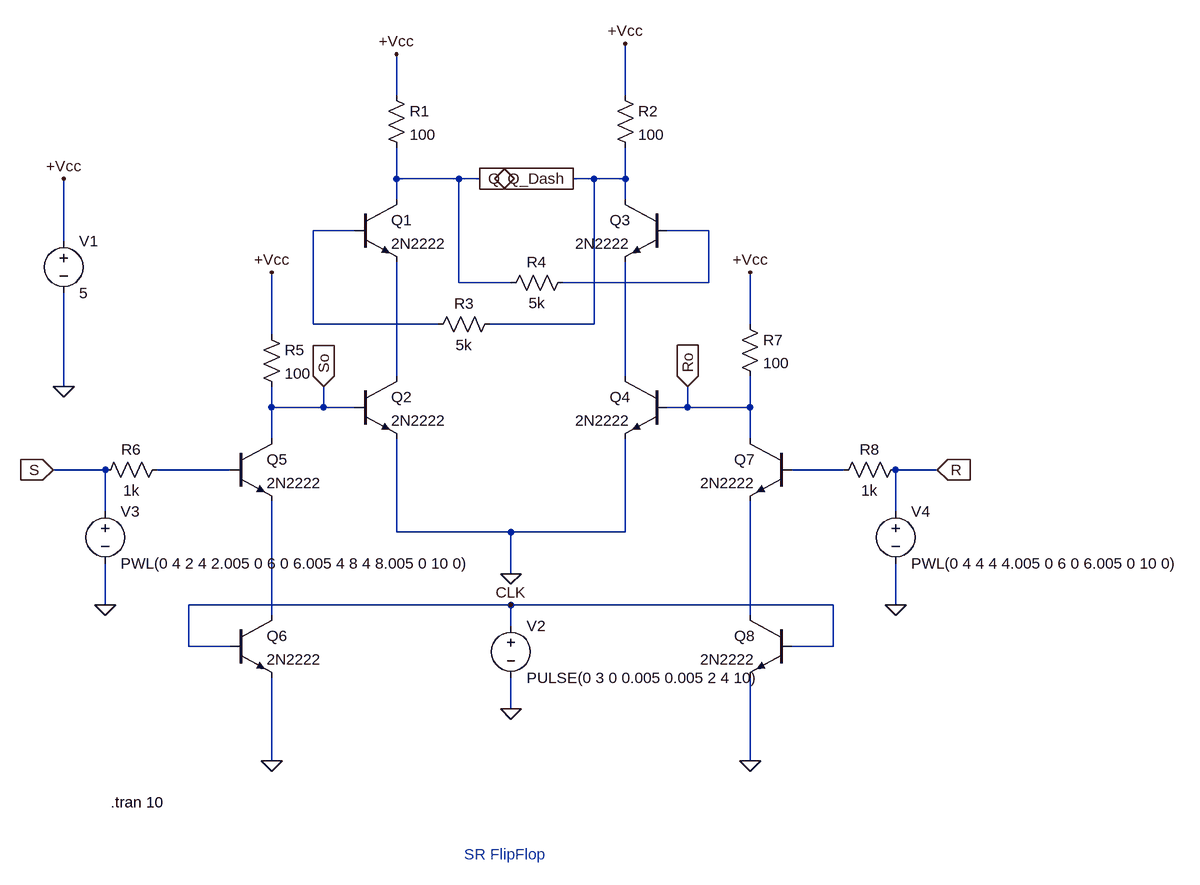
[diagram p0: schematic SR FlipFlop.asc]
SR FlipFlop.asc, the LTspice schematic file:
Version 4
SHEET 1 1156 800
WIRE -80 -384 -80 -448
WIRE 272 -384 272 -464
WIRE -80 -256 -80 -304
WIRE 16 -256 -80 -256
WIRE 48 -256 16 -256
WIRE 224 -256 192 -256
WIRE 272 -256 272 -304
WIRE 272 -256 224 -256
WIRE -80 -224 -80 -256
WIRE 272 -224 272 -256
WIRE -144 -176 -208 -176
WIRE 400 -176 336 -176
WIRE -592 -160 -592 -256
WIRE 16 -96 16 -256
WIRE 96 -96 16 -96
WIRE 400 -96 400 -176
WIRE 400 -96 176 -96
WIRE -208 -32 -208 -176
WIRE -16 -32 -208 -32
WIRE 224 -32 224 -256
WIRE 224 -32 64 -32
WIRE 464 -32 464 -112
WIRE -272 -16 -272 -112
WIRE -80 48 -80 -128
WIRE 272 48 272 -128
WIRE -592 64 -592 -80
WIRE -272 96 -272 64
WIRE -192 96 -192 64
WIRE -192 96 -272 96
WIRE -144 96 -192 96
WIRE 368 96 368 64
WIRE 368 96 336 96
WIRE 464 96 464 48
WIRE 464 96 368 96
WIRE -272 144 -272 96
WIRE 464 144 464 96
WIRE -528 192 -608 192
WIRE -336 192 -448 192
WIRE 608 192 528 192
WIRE 752 192 688 192
WIRE -528 256 -528 192
WIRE 688 256 688 192
WIRE -80 288 -80 144
WIRE 96 288 -80 288
WIRE 272 288 272 144
WIRE 272 288 96 288
WIRE 96 352 96 288
WIRE -528 400 -528 336
WIRE 96 400 -400 400
WIRE 592 400 96 400
WIRE 688 400 688 336
WIRE -272 416 -272 240
WIRE 464 416 464 240
WIRE 96 432 96 400
WIRE -400 464 -400 400
WIRE -336 464 -400 464
WIRE 592 464 592 400
WIRE 592 464 528 464
WIRE 96 560 96 512
WIRE -272 640 -272 512
WIRE 464 640 464 512
FLAG 96 352 0
FLAG -592 64 0
FLAG -592 -256 +Vcc
FLAG -80 -448 +Vcc
FLAG 272 -464 +Vcc
FLAG 48 -256 Q
IOPIN 48 -256 Out
FLAG 192 -256 Q_Dash
IOPIN 192 -256 Out
FLAG -272 -112 +Vcc
FLAG 464 -112 +Vcc
FLAG 96 560 0
FLAG -272 640 0
FLAG 464 640 0
FLAG -528 400 0
FLAG 688 400 0
FLAG -192 64 So
IOPIN -192 64 In
FLAG 368 64 Ro
IOPIN 368 64 In
FLAG -608 192 S
IOPIN -608 192 In
FLAG 752 192 R
IOPIN 752 192 In
FLAG 96 400 CLK
SYMBOL npn -144 -224 R0
SYMATTR InstName Q1
SYMATTR Value 2N2222
SYMBOL npn -144 48 R0
SYMATTR InstName Q2
SYMATTR Value 2N2222
SYMBOL npn 336 -224 M0
SYMATTR InstName Q3
SYMATTR Value 2N2222
SYMBOL npn 336 48 M0
SYMATTR InstName Q4
SYMATTR Value 2N2222
SYMBOL voltage -592 -176 R0
SYMATTR InstName V1
SYMATTR Value 5
SYMBOL res -96 -400 R0
SYMATTR InstName R1
SYMATTR Value 100
SYMBOL res 256 -400 R0
SYMATTR InstName R2
SYMATTR Value 100
SYMBOL res 80 -48 R90
WINDOW 0 0 56 VBottom 2
WINDOW 3 32 56 VTop 2
SYMATTR InstName R3
SYMATTR Value 5k
SYMBOL res 192 -112 R90
WINDOW 0 0 56 VBottom 2
WINDOW 3 32 56 VTop 2
SYMATTR InstName R4
SYMATTR Value 5k
SYMBOL npn -336 144 R0
SYMATTR InstName Q5
SYMATTR Value 2N2222
SYMBOL npn -336 416 R0
SYMATTR InstName Q6
SYMATTR Value 2N2222
SYMBOL npn 528 144 M0
SYMATTR InstName Q7
SYMATTR Value 2N2222
SYMBOL npn 528 416 M0
SYMATTR InstName Q8
SYMATTR Value 2N2222
SYMBOL voltage 96 416 R0
WINDOW 123 0 0 Left 0
WINDOW 39 0 0 Left 0
SYMATTR InstName V2
SYMATTR Value PULSE(0 3 0 0.005 0.005 2 4 10)
SYMBOL res -288 -32 R0
SYMATTR InstName R5
SYMATTR Value 100
SYMBOL res 448 -48 R0
SYMATTR InstName R7
SYMATTR Value 100
SYMBOL res -432 176 R90
WINDOW 0 0 56 VBottom 2
WINDOW 3 32 56 VTop 2
SYMATTR InstName R6
SYMATTR Value 1k
SYMBOL res 704 176 R90
WINDOW 0 0 56 VBottom 2
WINDOW 3 32 56 VTop 2
SYMATTR InstName R8
SYMATTR Value 1k
SYMBOL voltage -528 240 R0
WINDOW 123 0 0 Left 0
WINDOW 39 0 0 Left 0
SYMATTR InstName V3
SYMATTR Value PWL(0 4 2 4 2.005 0 6 0 6.005 4 8 4 8.005 0 10 0)
SYMBOL voltage 688 240 R0
WINDOW 123 0 0 Left 0
WINDOW 39 0 0 Left 0
SYMATTR InstName V4
SYMATTR Value PWL(0 4 4 4 4.005 0 6 0 6.005 0 10 0)
TEXT 24 784 Left 2 ;SR FlipFlop
TEXT -520 704 Left 2 !.tran 10

The netlist it stands for:
* SR FlipFlop.asc
Q1 Q N001 N003 0 2N2222
Q2 N003 So 0 0 2N2222
Q3 Q_Dash N002 N004 0 2N2222
Q4 N004 Ro 0 0 2N2222
V1 +Vcc 0 5
R1 +Vcc Q 100
R2 +Vcc Q_Dash 100
R3 Q_Dash N001 5k
R4 N002 Q 5k
Q5 So N005 N007 0 2N2222
Q6 N007 CLK 0 0 2N2222
Q7 Ro N006 N008 0 2N2222
Q8 N008 CLK 0 0 2N2222
V2 CLK 0 PULSE(0 3 0 0.005 0.005 2 4 10)
R5 +Vcc So 100
R7 +Vcc Ro 100
R6 N005 S 1k
R8 R N006 1k
V3 S 0 PWL(0 4 2 4 2.005 0 6 0 6.005 4 8 4 8.005 0 10 0)
V4 R 0 PWL(0 4 4 4 4.005 0 6 0 6.005 0 10 0)
.model NPN NPN
.model PNP PNP
.lib standard.bjt
* SR FlipFlop
.tran 10
.backanno
.end